# Altium schematic sheet SHDN-S11-V00-7SegmentDisplay.SchDoc: 7 Segment Display (0.56")
size A3; DrawnBy: Jonn Dillon; DocumentNumber: 11; SheetNumber: 11; SheetTotal: 11; Project: Shutdown Board 2020
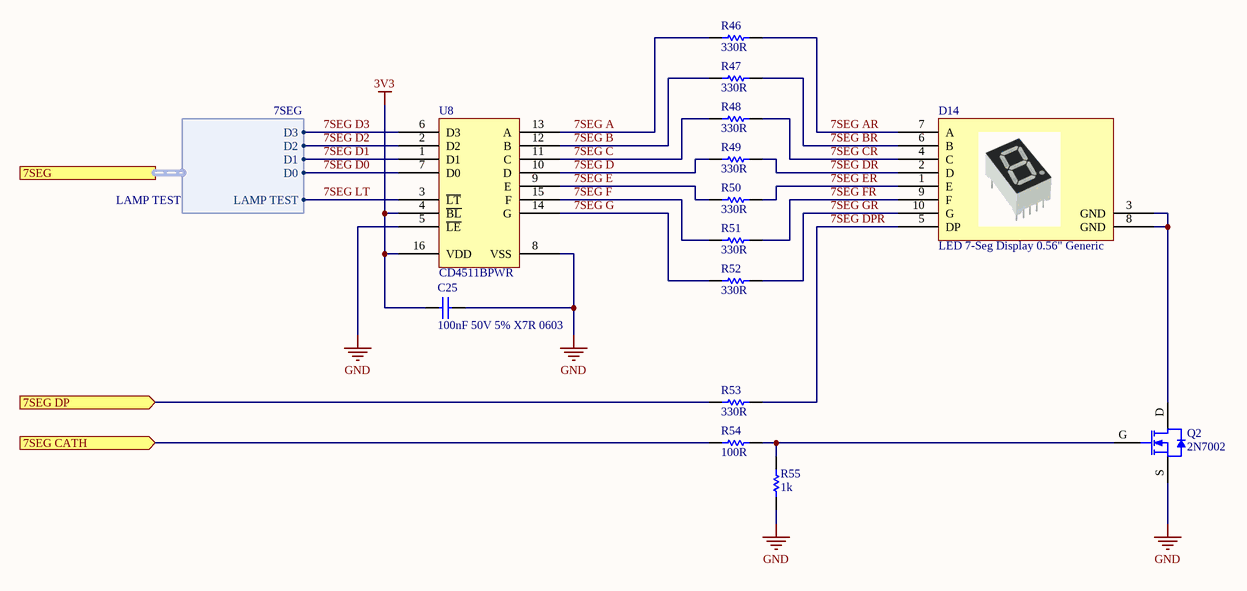
[diagram p0: SHDN-S11-V00-7SegmentDisplay.SchDoc]

## Parts
C25  100nF 50V 5% X7R 0603  [Cap_Ceramic_0603]
D14  LED 7-Seg Display 0.56" Generic  [LED 7 SEG 0.56"]
Q2  2N7002  [SOT23-3]
R46  330R  [Res_ThinFilm_0603]
R47  330R  [Res_ThinFilm_0603]
R48  330R  [Res_ThinFilm_0603]
R49  330R  [Res_ThinFilm_0603]
R50  330R  [Res_ThinFilm_0603]
R51  330R  [Res_ThinFilm_0603]
R52  330R  [Res_ThinFilm_0603]
R53  330R  [Res_ThinFilm_0603]
R54  100R  [Res_ThinFilm_0603]
R55  1k  [Res_ThinFilm_0603]
U8  CD4511BPWR  [16-TSSOP]

## Ports
7SEG (harness 7SEG), 7SEG CATH (in), 7SEG DP (in)

## Harnesses
7SEG: D3, D2, D1, D0, LAMP TEST

## Nets
3V3: C25.1 U8.4(~{BL}) U8.16(VDD)
GND: C25.2 Q2.S R55.1 U8.5(~{LE}) U8.8(VSS)
7SEG A: R46.1 U8.13(A)
7SEG AR: D14.7(A) R46.2
7SEG B: R47.1 U8.12(B)
7SEG BR: D14.6(B) R47.2
7SEG C: R48.1 U8.11(C)
7SEG CATH: R54.1 ; port 7SEG CATH
7SEG CR: D14.4(C) R48.2
7SEG D: R49.1 U8.10(D)
7SEG D0: U8.7(D0) ; port 7SEG.D0
7SEG D1: U8.1(D1) ; port 7SEG.D1
7SEG D2: U8.2(D2) ; port 7SEG.D2
7SEG D3: U8.6(D3) ; port 7SEG.D3
7SEG DP: R53.1 ; port 7SEG DP
7SEG DPR: D14.5(DP) R53.2
7SEG DR: D14.2(D) R49.2
7SEG E: R50.1 U8.9(E)
7SEG ER: D14.1(E) R50.2
7SEG F: R51.1 U8.15(F)
7SEG FR: D14.9(F) R51.2
7SEG G: R52.1 U8.14(G)
7SEG GR: D14.10(G) R52.2
7SEG LT: U8.3(~{LT}) ; port 7SEG.LAMP TEST
NetD14_3: D14.3(GND) D14.8(GND) Q2.D
NetQ2_G: Q2.G R54.2 R55.2

## Notes on the sheet
- LAMP TEST
- Revision History:
- Sheet Title:
- Rev
- Date
- Description
- Project:
- Size:
- Drawn By:
- A3
- Number:
- Revision:
- Sheet
- Version:
- of
- QUT Motorsport
- O-120, Gardens Point
- 2 George Street
- Brisbane, QLD 4000
- Australia
- Print Date:
- Print Time:
- File Name:

## Library data of the parts
C25 = 100nF 50V 5% X7R 0603: Capacitor, Ceramic, SMD, 100nF, 50V, 5%, X7R, 0603
D14 = LED 7-Seg Display 0.56"
R46-R53 = 330R 5% 0603: Resistor, SMD, 330R, 0.1W, 5%, 0603
R54 = 100R 5%, 0603: Resistor, SMD, 100R, 0.1W, 5%, 0603
R55 = 1k 5% 0603: Resistor, SMD, 1k, 0.1W, 5%, 0603
U8 = CD4511BPWR: LED Driver 7 Segment 16-TSSOP